# EAGLE schematic kegboard-mini (EAGLE 6.2)
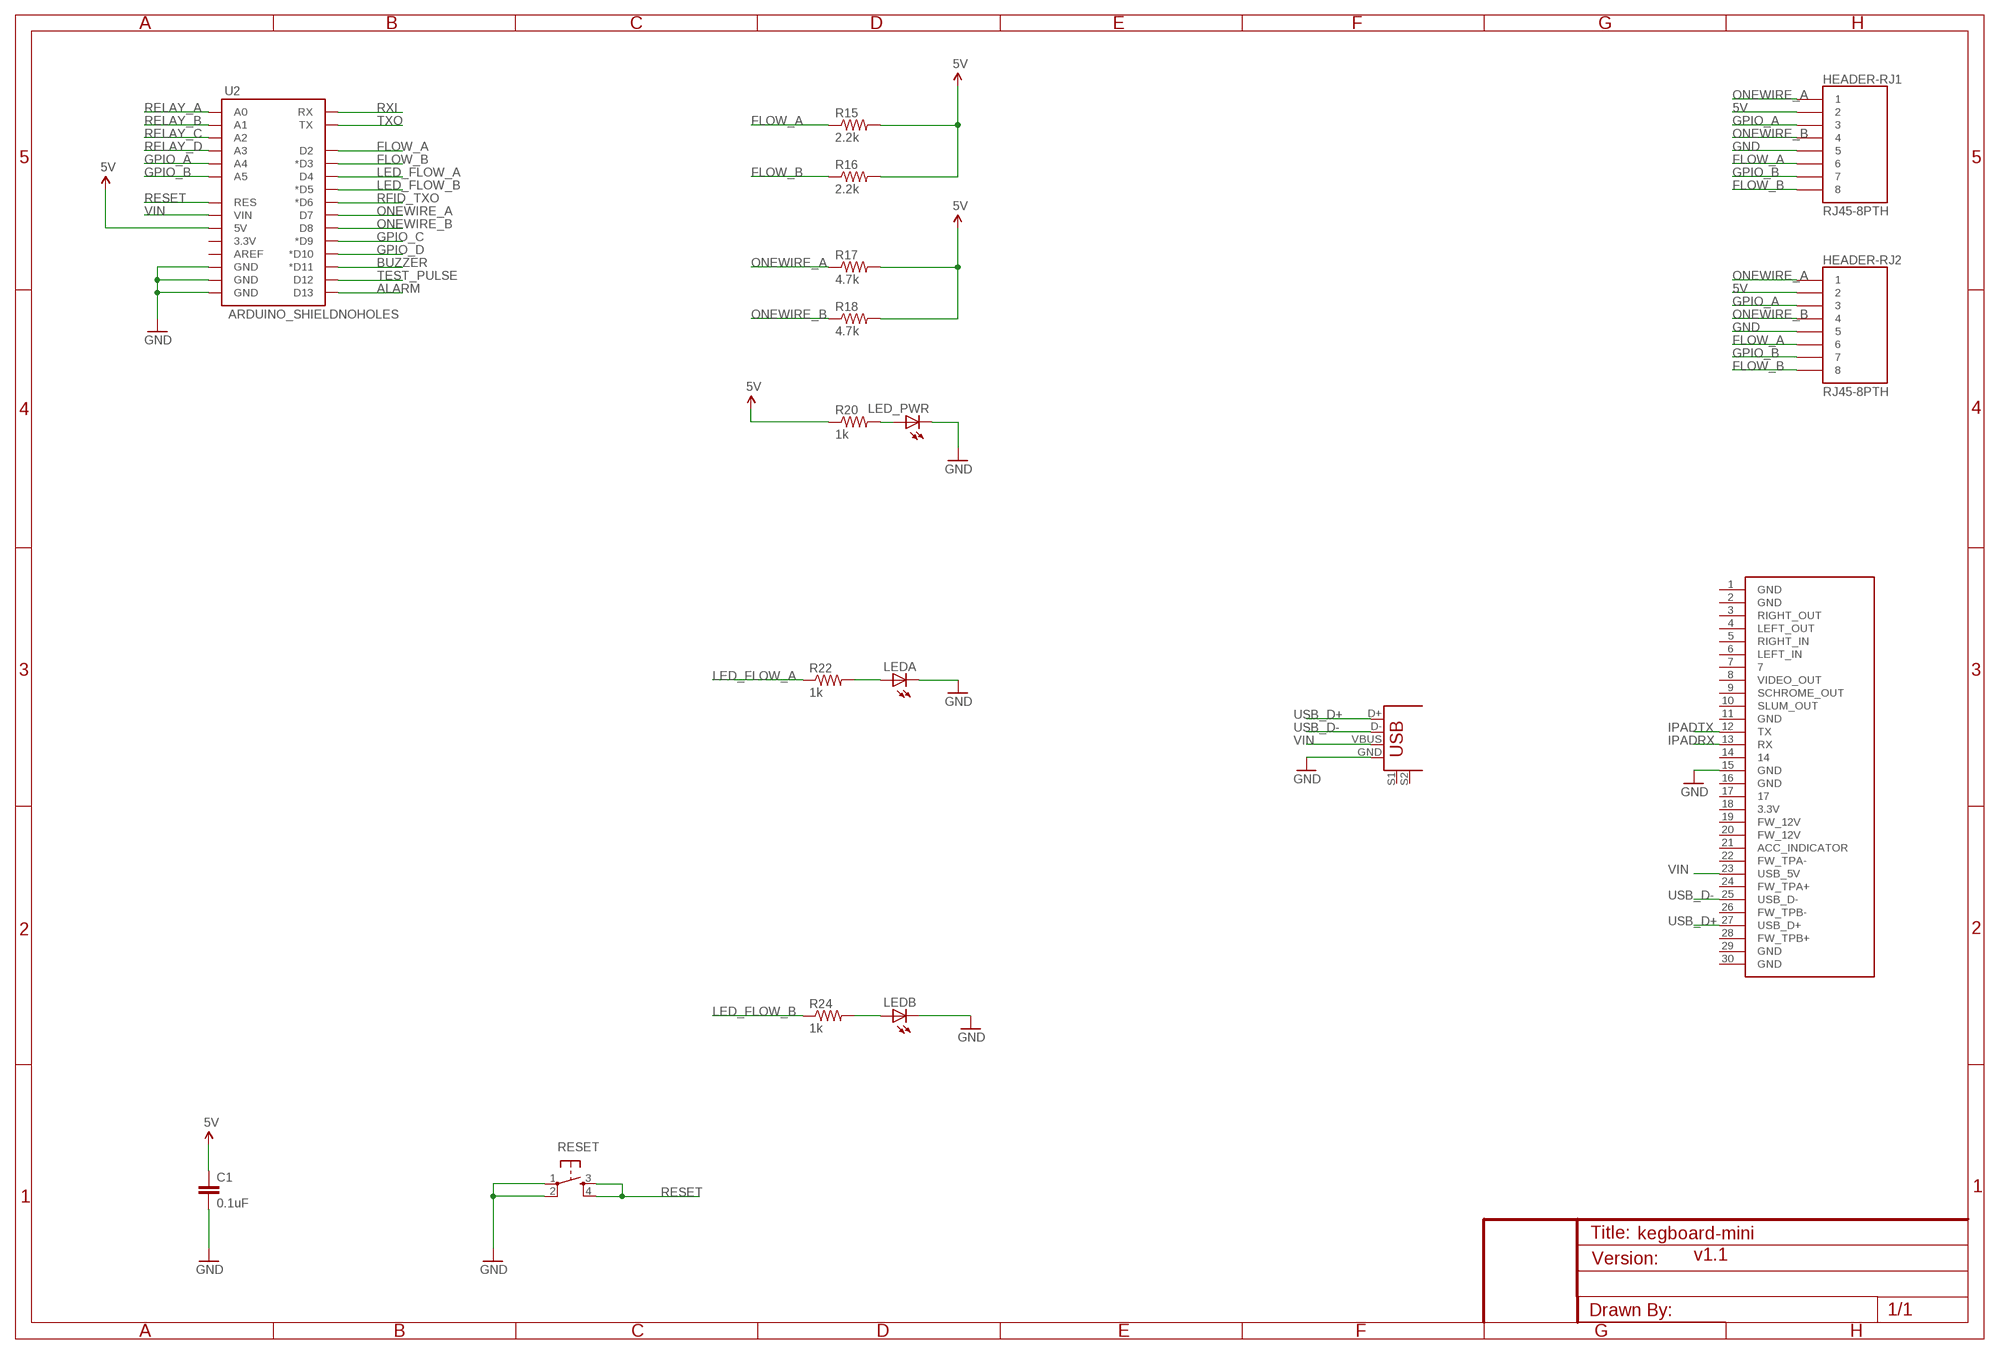
[diagram p0: schematic, sheet 1]

## Parts
C1  0.1uF  CAPPTH  [CAP-PTH-SMALL]
HEADER-RJ1  RJ45-8PTH  [RJ45-8]
HEADER-RJ2  RJ45-8PTH  [RJ45-8]
LED_PWR  LED3MM  [LED3MM]
LEDA  LED3MM  [LED3MM]
LEDB  LED3MM  [LED3MM]
R15  2.2k  RESISTORPTH1  [AXIAL-0.3]
R16  2.2k  RESISTORPTH1  [AXIAL-0.3]
R17  4.7k  RESISTORPTH1  [AXIAL-0.3]
R18  4.7k  RESISTORPTH1  [AXIAL-0.3]
R20  1k  RESISTORPTH1  [AXIAL-0.3]
R22  1k  RESISTORPTH1  [AXIAL-0.3]
R24  1k  RESISTORPTH1  [AXIAL-0.3]
RESET  TAC_SWITCHPTH  [TACTILE-PTH]
U2  ARDUINO_SHIELDNOHOLES  [DUEMILANOVE_SHIELD_NOHOLES]
U$2  USB+SHIELD  [USB-B-PTH]
U$19  IPOD_CONNECTOR_MALE  [IPOD_MALE_CONNECTOR]

## Nets
5V: C1.1 HEADER-RJ1.2 HEADER-RJ2.2 R15.P$2 R16.P$2 R17.P$2 R18.P$2 R20.P$1 U2.5V
ALARM: U2.D13
BUZZER: U2.D11(*D11)
FLOW_A: HEADER-RJ1.6 HEADER-RJ2.6 R15.P$1 U2.D2
FLOW_B: HEADER-RJ1.8 HEADER-RJ2.8 R16.P$1 U2.D3(*D3)
GND: C1.2 HEADER-RJ1.5 HEADER-RJ2.5 LED_PWR.K(C) LEDB.K(C) RESET.1 RESET.2 U2.GND@0(GND) U2.GND@1(GND) U2.GND@2(GND) U$2.GND U$19.15(GND)
GPIO_A: HEADER-RJ1.3 HEADER-RJ2.3 U2.A4
GPIO_B: HEADER-RJ1.7 HEADER-RJ2.7 U2.A5
GPIO_C: U2.D9(*D9)
GPIO_D: U2.D10(*D10)
IPADRX: U$19.13(RX)
IPADTX: U$19.12(TX)
LED_FLOW_A: R22.P$1 U2.D4
LED_FLOW_B: R24.P$1 U2.D5(*D5)
N$1: LEDA.A R22.P$2
N$2: LEDB.A R24.P$2
N$13: LED_PWR.A R20.P$2
ONEWIRE_A: HEADER-RJ1.1 HEADER-RJ2.1 R17.P$1 U2.D7
ONEWIRE_B: HEADER-RJ1.4 HEADER-RJ2.4 R18.P$1 U2.D8
RELAY_A: U2.A0
RELAY_B: U2.A1
RELAY_C: U2.A2
RELAY_D: U2.A3
RESET: RESET.3 RESET.4 U2.RES
RFID_TXO: U2.D6(*D6)
RXI: U2.RX
TEST_PULSE: U2.D12
TXO: U2.TX
USB_D+: U$2.D+ U$19.27(USB_D+)
USB_D-: U$2.D- U$19.25(USB_D-)
VIN: U2.VIN U$2.VBUS U$19.23(USB_5V)
Unconnected: LEDA.K(C) U2.3.3V U2.AREF U$2.S1 U$2.S2 U$19.1(GND) U$19.2(GND) U$19.3(RIGHT_OUT) U$19.4(LEFT_OUT) U$19.5(RIGHT_IN) U$19.6(LEFT_IN) U$19.7 U$19.8(VIDEO_OUT) U$19.9(SCHROME_OUT) U$19.10(SLUM_OUT) U$19.11(GND) U$19.14 U$19.16(GND) U$19.17 U$19.18(3.3V) U$19.19(FW_12V) U$19.20(FW_12V) U$19.21(ACC_INDICATOR) U$19.22(FW_TPA-) U$19.24(FW_TPA+) U$19.26(FW_TPB-) U$19.28(FW_TPB+) U$19.29(GND) U$19.30(GND)

## Notes on the sheet
- v1.1

## Library data of the parts
C1 = SparkFun:CAP: Capacitor Standard 0603 ceramic capacitor, and 0.1" leaded capacitor.
HEADER-RJ1 HEADER-RJ2 = SparkFun:RJ45-8: RJ45 Jack Simple RJ45, 8-pin connection - connector for common Cat5, Cat5e, and Cat6 Ethernet cables. Footprint not yet proven in production. Connector sku is PRT-00643; Breakout PCB sku is BOB-00716.
LED_PWR LEDA LEDB = SparkFun:LED: LEDs Standard schematic elements and footprints for 5mm, 3mm, 1206, and 0603 sized LEDs. 5mm - Spark Fun Electronics SKU : COM-00529 (and others)
R15-R18 R20 R22 R24 = SparkFun:RESISTOR: Resistor Basic schematic elements and footprints for 0603, 1206, and PTH 1/10th watt (small) resistors.
RESET = SparkFun:TAC_SWITCH: Momentary Switch Button commonly used for reset or general input. Spark Fun Electronics SKU : COM-00097
U2 = SparkFun:ARDUINO_SHIELD
U$2 = SparkFun-Connectors:USB+SHIELD: USB+Shield USB connector with shield pins connectable
U$19 = SparkFun:IPOD_CONNECTOR_MALE: iPod Male Connector This is the connector that will insert into an iPods. Use this connector to gain access to the various iPod pins. Schematic and footprint are not yet production proven. The PCB thickness must be more thin than the standard 0.062" FR4. Spark Fun Electronics SKU : DEV-00633